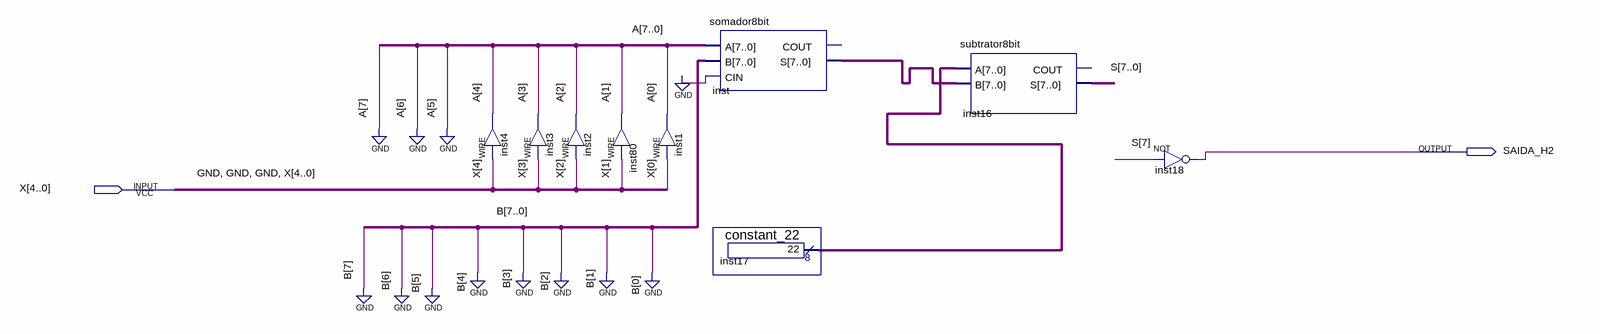
[diagram p0: schematic sheet]
// Quartus schematic quadrado_h2.bdf as structural Verilog: 9 symbols, 2 pins
module quadrado_h2 (
  input  [4:0] X,
  output SAIDA_H2
);

  wire [4:0] A;
  wire [7:0] inst17_result, inst_s, S;

  assign A[4] = X[4];  // WIRE inst4
  assign A[3] = X[3];  // WIRE inst3
  assign A[2] = X[2];  // WIRE inst2
  assign A[1] = X[1];  // WIRE inst80
  somador8bit inst (.A({3'b000, A}), .B({8{1'b0}}), .CIN(1'b0), .S(inst_s));  // open: COUT
  assign A[0] = X[0];  // WIRE inst1
  constant_22 inst17 (.result(inst17_result));
  subtrator8bit inst16 (.A(inst17_result), .B(inst_s), .S(S));  // open: COUT
  not inst18 (SAIDA_H2, S[7]);
endmodule
